# EasyEDA Pro project ProPrj_Smart_Screen_T113_PCB6.epro, board PCB
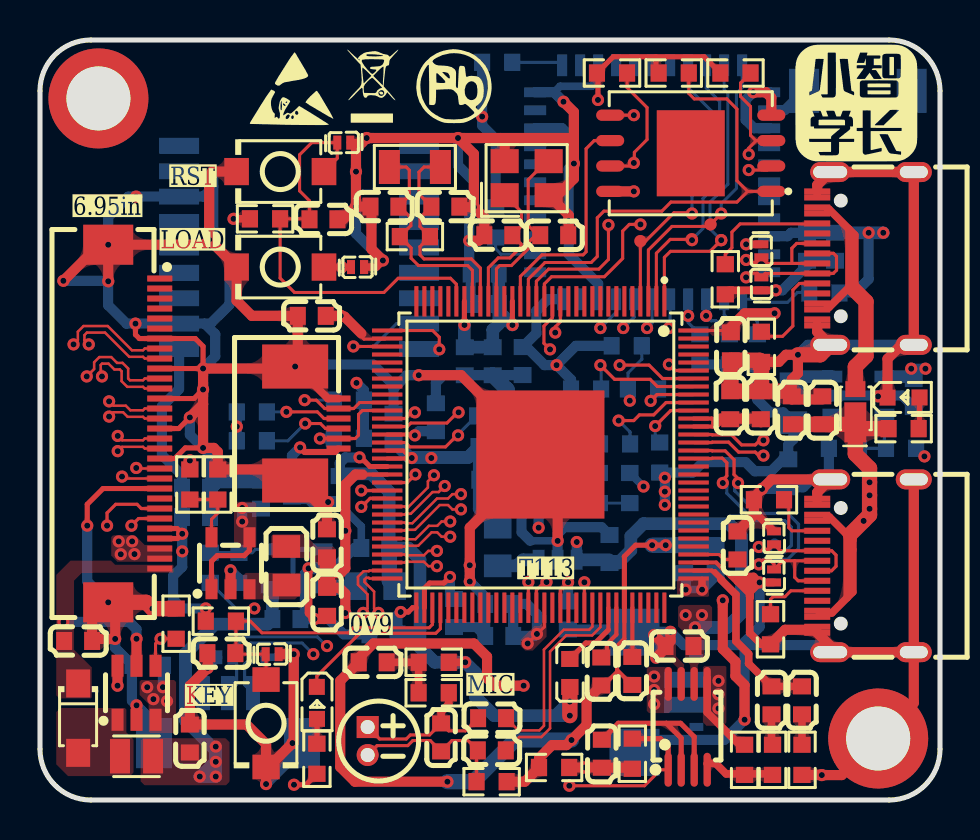
[diagram p7: board, top side]
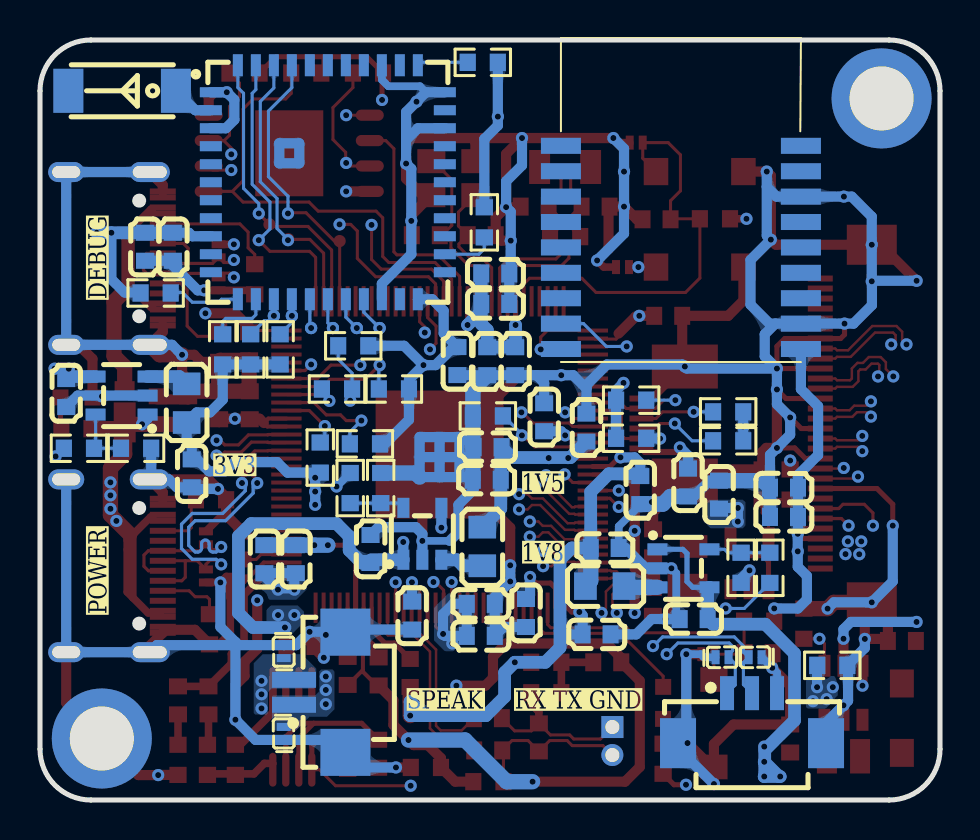
[diagram p8: board, bottom side, seen from below]

Outline 45 x 38 mm; copper layers: Top Layer, GND02, SIG03, Power04, GND05, Bottom Layer. Coordinates in mm from the lower left corner of the outline.
Outline path: 0,35.46 0,2.54 arc(0.74,0.74) 2.54,0 42.46,0 arc(44.26,0.74) 45,2.54 45,35.46 arc(44.26,37.26) 42.46,38 2.54,38 arc(0.74,37.26) 0,35.46
Stack: Top Layer 0.035mm 外层铜厚1oz / Dielectric1 0.0994mm 3313 RC57% 4.2mil / GND02 0.035mm / Dielectric2 0.55mm 0.55mm H/H No copper / SIG03 0.035mm / Dielectric3 0.1088mm 2116 RC54% 4.9mil / Power04 0.0152mm 内层铜厚 / Dielectric4 0.55mm 0.55mm H/H No copper / GND05 0.0152mm 内层铜厚 / Dielectric5 0.0994mm 3313 RC57% 4.2mil / Bottom Layer 0.035mm 外层铜厚1oz

## Design rules (mm)
net MIC_IN_3P: DP8
net MIC_IN_3N: DP8
net USB1_DP: DP1
net USB1_DM: DP1
net USB0_DM: DP2
net USB0_DP: DP2
net LCD_CLK_P: DP3
net LCD_CLK_N: DP3
net MIPI_0_P: DP10
net MIPI_0_N: DP10
net MIPI_1_P: DP11
net MIPI_1_N: DP11
net MIPI_2_P: DP12
net MIPI_2_N: DP12
net MIPI_3_P: DP13
net MIPI_3_N: DP13
template: 自定义配置
spacing copperThickness1oz (default): track to track 0.102, other pairs 0.152 to 0.3
spacing copperThickness2oz: track to track 0.203, other pairs 0.152 to 0.3
track width copperThickness1oz (default): min 0.127, default 0.152, max 2.54
track width copperThickness2oz: min 0.203, default 0.254, max 2.54
track width 3313_50ohm_单端: min 0.157, default 0.157, max 0.157
differential pair differentialPair (default): width min 0.127, default 0.127, max 2.54; gap min 0.152, default 0.203
differential pair 3313_100ohm_差分: width min 0.124, default 0.124, max 0.124; gap min 0.203, default 0.203
differential pair 3313_90ohm_差分: width min 0.157, default 0.157, max 0.157; gap min 0.203, default 0.203
via viaSize (default): diameter min 0.5, default 0.61, max 10; hole min 0.3, default 0.305, max 6.299
net WL_SDIO_D1 uses 3313_50ohm_单端
net WL_SDIO_D0 uses 3313_50ohm_单端
net WL_SDIO_CMD uses 3313_50ohm_单端
net WL_SDIO_D3 uses 3313_50ohm_单端
net WL_SDIO_D2 uses 3313_50ohm_单端
net WL_SDIO_CLK uses 3313_50ohm_单端
net USB1_DP uses 3313_90ohm_差分
net USB1_DM uses 3313_90ohm_差分
net USB0_DM uses 3313_90ohm_差分
net USB0_DP uses 3313_90ohm_差分
net LCD_CLK_P uses 3313_100ohm_差分
net LCD_CLK_N uses 3313_100ohm_差分
net MIPI_LCD_RST uses 3313_50ohm_单端
net MIPI_LCD_TE uses 3313_50ohm_单端
net MIPI_0_P uses 3313_100ohm_差分
net MIPI_0_N uses 3313_100ohm_差分
net MIPI_1_P uses 3313_100ohm_差分
net MIPI_1_N uses 3313_100ohm_差分
net MIPI_2_P uses 3313_100ohm_差分
net MIPI_2_N uses 3313_100ohm_差分
net MIPI_3_P uses 3313_100ohm_差分
net MIPI_3_N uses 3313_100ohm_差分
diff pair DP1 uses 3313_90ohm_差分
diff pair DP2 uses 3313_90ohm_差分
diff pair DP3 uses 3313_100ohm_差分
diff pair DP10 uses 3313_100ohm_差分
diff pair DP11 uses 3313_100ohm_差分
diff pair DP12 uses 3313_100ohm_差分
diff pair DP13 uses 3313_100ohm_差分

## Placement (name value [footprint] x y rotation side)
C1  100nF  [C0603]  20.7 9.35 270 bottom
C9  10uF  [C0603]  22.96 9.81 0 bottom
C12  100nF  [C0603]  22.96 8.21 0 bottom
C13  10uF  [C0603]  17.68 18.62 270 bottom
C14  100nF  [C0603]  22.62 17.64 180 bottom
C15  100nF  [C0603]  26.39 9.22 90 bottom
C16  100nF  [C0603]  12.6 15.88 90 bottom
C17  100nF  [C0603]  13.59 24.21 0 top
C19  100nF  [C0603]  34.54 22.68 90 top
C21  100nF  [C0603]  22.64 21.94 90 bottom
C27  10uF  [C0603]  14.35 12.83 270 top
C28  10uF  [C0603]  34.51 19.74 270 top
C29  100nF  [C0603]  19.79 19.14 270 bottom
C30  100nF  [C0603]  36.04 19.74 270 top
C31  10uF  [C0603]  32.21 12.04 270 bottom
C33  10uF  [C0603]  22.24 24.8 0 bottom
C34  100nF  [C0603]  22.24 26.33 0 bottom
C36  100nF  [C0603]  14.99 15.5 90 bottom
C37  100nF  [C0603]  17.17 8.28 0 bottom
C38  100nF  [C0603]  21.24 21.94 90 bottom
C41  100nF  [C0603]  14.17 29.03 180 top
C63  100nF  [C0603]  38.35 27.66 90 bottom
C64  10uF  [C0603]  39.75 27.66 90 bottom
C65  10uF  [C0603]  24.13 21.95 90 bottom
C82  470nF  [C0603]  29.62 6.45 270 top
C83  470nF  [C0603]  28.07 6.43 270 top
C85  100nF  [C0603]  22.61 4.09 0 top
C86  100nF  [C0603]  22.59 2.48 0 top
C87  100pF  [C0603]  20.06 3.13 90 top
C88  2.2uF  [C0603]  33.78 12.04 270 bottom
C91  100nF  [C0603]  34.87 12.73 270 top
C107  10uF  [C0603]  43.69 20.35 90 bottom
C108  10uF  [C0603]  37.41 16.33 90 bottom
C109  10uF  [C0603]  28.47 12.55 270 bottom
C110  10uF  [C0603]  22.66 16.01 180 bottom
C111  10uF  [C0603]  11.05 15.27 270 bottom
C112  10uF  [C0603]  14.36 9.91 90 top
C115  10uF  [C0603]  39.12 19.48 270 top
C116  100nF  [C0603]  37.59 19.48 270 top
C119  1uF  [C0603]  1.91 7.95 180 top
C120  12pF  [C0603]  20.27 29.67 0 top
C121  12pF  [C0603]  17.22 29.67 0 top
C122  12pF  [C0603]  22.92 28.24 0 top
C123  12pF  [C0603]  25.71 28.24 180 top
C124  100nF  [C0603]  9.07 7.34 0 top
C135  100nF  [C0603]  38.1 4.98 270 top
C138  1uF  [C0603]  28.09 2.31 90 top
C139  10uF  [C0603]  31.98 7.7 0 top
C141  1uF  [C0603]  7.49 3.08 270 top
C142  470nF  [C0603]  36.58 4.98 270 top
C143  10uF  [C0603]  16.64 6.88 180 top
C144  10uF  [C0603]  7.8 15.62 180 bottom
C145  100nF  [C0603]  7.8 14.15 180 bottom
C146  10uF  [C0603]  12.32 9.04 180 bottom
C147  10uF  [C0603]  16.76 12.6 0 bottom
CN2  HC-1.25-2PWT  [CONN-SMD_2P-P1.25-HC-1.25-2PWT]  31.01 5.39 90 bottom
D19  LMBR240ET1G  [SOD323HE_L1.8-W1.3-LS2.5-RD-1]  40.77 19.71 90 top
D22  LMBR240FT1G  [SOD-123FL_L2.7-W1.8-LS3.8-RD]  1.91 4.09 270 top
FPC2  FPC-05F-30PH20  [FPC-SMD_30P-P0.50_XUNPU_FPC-05F-30PH20]  4.7 18.82 270 top
FPC7  AFC07-S06ECA-00  [FPC-SMD_P0.50-6P_LCS-SJ-H2.0]  13.84 18.82 90 top
L8  GZ1608D601TF  [L0603]  26.49 6.35 270 top
L10  AN2051-245  [ANT2051]  40.89 35.46 0 bottom
L15  2.2uH  [L0805]  37.67 19.84 270 bottom
L16  2.2uH  [L0805]  22.89 12.68 90 bottom
L17  2.2uH  [L0805]  12.32 11.71 90 top
L18  10uH  [IND-SMD_L2.0-W1.6]  4.83 2.19 0 top
L19  2.2uH  [L0805]  16.76 10.69 0 bottom
LED3  NCD0603B1  [LED0603-RD]  43.18 20.12 0 top
LED4  NCD0603B1  [LED0603-RD]  13.84 4.86 270 top
MIC2  GMI4015P-2C-42db  [MIC-TH_BD4.0-P1.40-D0.4-L-FD]  16.38 2.95 270 top
NOREF  -  [Pad_e3778]  32.59 28.04 180 top
NOREF#2  -  [Pad_e3757]  29.16 23.6 0 top
NOREF#3  -  [Pad_e3754]  33.31 24.21 0 top
NOREF#4  -  [Pad_e3755]  32.41 24.21 0 top
NOREF#5  -  [Pad_e3756]  28.02 23.6 0 top
NOREF#6  -  [Pad_e12601]  2.92 35.08 180 top
NOREF#7  -  [Pad_e3765]  30.35 23.6 180 top
NOREF#8  -  [Pad_e3768]  34.06 27.99 180 top
NOREF#9  -  [Pad_e12602]  41.91 3.08 180 top
NOREF#10  -  [Pad_e3767]  30.02 27.95 180 top
NOREF#11  -  [Pad_e3769]  33.53 28.78 180 top
NOREF#12  -  [Pad_e3763]  31.44 23.6 0 top
R13  10kΩ  [R0603]  11.25 29.06 180 top
R14  10MΩ  [R0603]  18.75 28.17 0 top
R52  10kΩ  [R0603]  22.86 36.88 180 bottom
R79  0Ω  [R0603]  25.7 1.63 180 top
R90  33Ω  [R0603]  30.15 20.55 180 bottom
R91  10kΩ  [R0603]  22.78 28.88 90 bottom
R93  10kΩ  [R0603]  28.6 36.35 180 top
R107  150kΩ  [R0603]  40.2 17.59 0 bottom
R108  680kΩ  [R0603]  43.05 17.59 0 bottom
R109  300kΩ  [R0603]  29.49 15.6 90 bottom
R110  150kΩ  [R0603]  7.49 15.77 90 top
R111  200kΩ  [R0603]  27.97 15.6 270 bottom
R112  300kΩ  [R0603]  8.89 15.77 270 top
R113  5.1kΩ  [R0603]  36.52 8.54 90 top
R114  5.1kΩ  [R0603]  36.45 15.01 180 top
R115  10kΩ  [R0603]  43.18 18.57 0 top
R120  10kΩ  [R0603]  6.81 8.82 270 top
R121  10Ω  [R0603]  5.38 6.73 0 bottom
R122  10kΩ  [R0603]  31.69 36.35 180 top
R123  240Ω  [R0603]  22.61 19.2 180 bottom
R124  10kΩ  [R0603]  13.84 2.06 90 top
R126  10kΩ  [R0603]  9.04 8.94 180 top
R135  22Ω  [R0603]  38.1 2.01 90 top
R136  20kΩ  [R0603]  36.63 2.01 270 top
R138  100kΩ  [R0603]  29.62 2.31 90 top
R141  5.1kΩ  [R0603]  36.07 22.66 90 top
R142  5.1kΩ  [R0603]  34.26 26.04 270 top
R145  10kΩ  [R0603]  34.77 36.35 0 top
R146  1kΩ  [R0603]  22.58 0.92 180 top
R147  1kΩ  [R0603]  19.69 5.36 180 top
R148  75Ω  [R0603]  19.69 6.88 0 top
R149  20kΩ  [R0603]  35.23 2.01 90 top
R150  200kΩ  [R0603]  8.51 11.61 270 bottom
R151  100kΩ  [R0603]  9.94 11.61 90 bottom
R152  10kΩ  [R0603]  32.99 22.53 270 bottom
R153  10kΩ  [R0603]  34.47 22.53 270 bottom
R154  10kΩ  [R0603]  35.86 22.53 270 bottom
R155  10kΩ  [R0603]  39.22 25.35 0 bottom
R156  10kΩ  [R0603]  27.3 20.55 180 bottom
R157  10kΩ  [R0603]  28.75 17.81 180 bottom
R158  10kΩ  [R0603]  29.34 22.71 180 bottom
R159  10kΩ  [R0603]  30.99 17.12 270 bottom
R160  10kΩ  [R0603]  15.44 18.09 0 bottom
R161  10kΩ  [R0603]  10.59 17.96 180 bottom
R162  10kΩ  [R0603]  10.59 19.41 180 bottom
R163  10kΩ  [R0603]  15.44 19.99 0 bottom
SW1  TS-1088-AR02016  [SW-SMD_L3.9-W3.0-P4.45]  12.01 26.65 180 top
SW2  TS-1088-AR02016  [SW-SMD_L3.9-W3.0-P4.45]  12.01 31.42 180 top
SW5  TS-1088-AR02016  [SW-SMD_L3.9-W3.0-P4.45]  11.3 3.84 270 top
T1  T113_S3  [TQFP-128_L14.0-W14.0-P0.40-LS16.0-BL-EP6.4]  25.02 17.27 180 top
U1  W25N01GVZEIG  [WSON-8_L8.0-W6.10-P1.27-BL-EP]  32.54 32.34 90 top
U5  -  [MX02]  6.98 21.87 90 bottom
U11  RTL8723DS模块  [WIFIM-SMD_44P-L12.0-W12.0-P0.90_RTL8723DS]  30.61 30.89 180 bottom
U21  ESD5451N  [X1-DFN1006-2_L1.0-W0.6-P0.65-BI]  15.88 26.65 0 top
U24  ZX-MX1.25-3PWT  [CONN-SMD_3P-P1.25_MEGASTAR_ZX-MX1.25-3PWT]  9.4 4.09 180 bottom
U27  SY8088AAC  [SOT-23-5_L3.0-W1.7-P0.95-LS2.8-BR]  40.92 20.22 180 bottom
U28  SY8088AAC  [SOT-23-5_L3.0-W1.7-P0.95-LS2.8-BR]  25.88 13.31 270 bottom
U29  SY8088AAC  [SOT-23-5_L3.0-W1.7-P0.95-LS2.8-BR]  9.52 11.84 270 top
U33  ESD5451N  [X1-DFN1006-2_L1.0-W0.6-P0.65-BI]  36.07 27.46 270 top
U34  ESD5451N  [X1-DFN1006-2_L1.0-W0.6-P0.65-BI]  36.07 25.81 270 top
U35  ESD5451N  [X1-DFN1006-2_L1.0-W0.6-P0.65-BI]  36.7 11.2 90 top
U36  ESD5451N  [X1-DFN1006-2_L1.0-W0.6-P0.65-BI]  36.7 13.11 270 top
U37  ESD5451N  [X1-DFN1006-2_L1.0-W0.6-P0.65-BI]  9.25 7.14 0 bottom
U38  ESD5451N  [X1-DFN1006-2_L1.0-W0.6-P0.65-BI]  10.9 7.14 0 bottom
U41  ESD5451N  [X1-DFN1006-2_L1.0-W0.6-P0.65-BI]  15.19 32.87 180 top
U42  ESD5451N  [X1-DFN1006-2_L1.0-W0.6-P0.65-BI]  11.61 7.29 180 top
U47  LM4890S  [MSOP-8_L3.0-W3.0-P0.65-LS5.0-BL]  32.38 3.66 0 top
U49  ESD5451N  [X1-DFN1006-2_L1.0-W0.6-P0.65-BI]  32.82 7.42 270 bottom
U50  ESD5451N  [X1-DFN1006-2_L1.0-W0.6-P0.65-BI]  32.82 3.33 90 bottom
U52  MT9201  [SOT-23-6_L2.9-W1.6-P0.95-LS2.8-BR]  4.83 5.36 270 top
U53  SY8088AAC  [SOT-23-5_L3.0-W1.7-P0.95-LS2.8-BR]  12.83 11.58 0 bottom
USB9  KH-TYPE-C-16P  [usb-c-smd_kh-type-c-16p]  41.27 11.71 90 top
USB10  KH-TYPE-C-16P  [usb-c-smd_kh-type-c-16p]  41.27 27.08 90 top
X1  XL2EL89COI-111YLC-24M  [CRYSTAL-SMD_4P-L3.2-W2.5-BL]  24.33 31.09 0 top
X2  32.768kHz  [OSC-SMD_L3.2-W1.5]  18.75 31.65 180 top

## Footprints (pads in the part's own frame, mm; a bottom-side part is the same pattern mirrored in y, then rotated)
ANT2051
  rect 1.5x2.2 smd: 1(-2.69,0) 2(2.69,0)
C0603
  rect 0.8x0.9 smd: 1(-0.7,0) 2(0.7,0)
CONN-SMD_2P-P1.25-HC-1.25-2PWT
  rect 0.8x2.2 smd: 1(-0.625,1.285) 2(0.625,1.285)
  rect 2.35x2.5 smd: 3(-3.005,-1.285) 4(3.005,-1.285)
CONN-SMD_3P-P1.25_MEGASTAR_ZX-MX1.25-3PWT
  rect 0.7x1.7 smd: 1(-1.25,1.25) 2(0,1.25) 3(1.25,1.25)
  rect 1.8x2.5 smd: 4(-3.7,-1.25) 5(3.7,-1.25)
CRYSTAL-SMD_4P-L3.2-W2.5-BL
  rect 1.4x1.2 smd: 1(-1.1,-0.85) 2(1.1,-0.85) 3(1.1,0.85) 4(-1.1,0.85)
FPC-SMD_30P-P0.50_XUNPU_FPC-05F-30PH20
  rect 0.3x1.25 smd: 1(-7.25,1.288) 2(-6.75,1.288) 3(-6.25,1.288) 4(-5.75,1.288) 5(-5.25,1.288) 6(-4.75,1.288) 7(-4.25,1.288) 8(-3.75,1.288) 9(-3.25,1.288) 10(-2.75,1.288) 11(-2.25,1.288) 12(-1.75,1.288) 13(-1.25,1.288) 14(-0.75,1.288) 15(-0.25,1.288) 16(0.25,1.288) 17(0.75,1.288) 18(1.25,1.288) 19(1.75,1.288) 20(2.25,1.288) 21(2.75,1.288) 22(3.25,1.288) 23(3.75,1.288) 24(4.25,1.288) 25(4.75,1.288) 26(5.25,1.288) 27(5.75,1.288) 28(6.25,1.288) 29(6.75,1.288) 30(7.25,1.288)
  rect 2x2.5 smd: 31(8.94,-1.288) 32(-8.94,-1.288)
FPC-SMD_P0.50-6P_LCS-SJ-H2.0
  rect 0.3x1.2 smd: 1(1.25,-1.085) 2(0.75,-1.085) 3(0.25,-1.085) 4(-0.25,-1.085) 5(-0.75,-1.085) 6(-1.25,-1.085)
  rect 2.2x3.3 smd: 7(2.85,1.085) 8(-2.85,1.085)
IND-SMD_L2.0-W1.6
  rect 1x1.72 smd: 1(0.828,0) 2(-0.828,0)
L0603
  rect 0.8x0.864 smd: 1(-0.7,0) 2(0.7,0)
L0805
  rect 1.133x1.377 smd: 1(-0.966,0) 2(0.966,0)
LED0603-RD
  rect 0.8x0.8 smd: 1(-0.799,-0.004) 2(0.799,0.004)
MIC-TH_BD4.0-P1.40-D0.4-L-FD
  rect 1.1x1.1 hole 0.7: 1(-0.7,0)
  round 1.1 hole 0.7: 2(0.7,0)
MSOP-8_L3.0-W3.0-P0.65-LS5.0-BL
  oval 0.364x1.692 smd: 1(-0.975,-2.146) 2(-0.325,-2.146) 3(0.325,-2.146) 4(0.975,-2.146) 5(0.975,2.146) 6(0.325,2.146) 7(-0.325,2.146) 8(-0.975,2.146)
MX02
  rect 0.8x2 smd: 1(10.838,11.969) 2(9.568,11.969) 3(8.298,11.969) 4(7.028,11.969) 5(5.758,11.969) 6(4.488,11.969) 7(3.218,11.969) 8(1.948,11.969) 9(0.678,11.969) 10(0.678,-0.031) 11(1.948,-0.031) 12(3.218,-0.031) 13(4.488,-0.031) 14(5.758,-0.031) 15(7.028,-0.031) 16(8.298,-0.031) 17(9.568,-0.031) 18(10.838,-0.031)
OSC-SMD_L3.2-W1.5
  rect 1.05x1.7 smd: 1(-1.275,0) 2(1.275,0)
Pad_e3754
  round 0.61 smd far side: TP22(0,0)
Pad_e3755
  round 0.61 smd far side: TP23(0,0)
Pad_e3756
  round 0.61 smd far side: TP24(0,0)
Pad_e3757
  round 0.61 smd far side: TP25(0,0)
Pad_e3763
  round 0.61 smd far side: TP26(0,0)
Pad_e3765
  round 0.61 smd far side: TP27(0,0)
Pad_e3767
  round 0.61 smd: TP28(0,0)
Pad_e3768
  round 0.61 smd: TP29(0,0)
Pad_e3769
  round 0.61 smd: TP30(0,0)
Pad_e3778
  round 0.61 smd: TP31(0,0)
Pad_e12601
  round 5 hole 3.2: 1(0,0)
Pad_e12602
  round 5 hole 3.2: 1(0,0)
R0603
  rect 0.806x0.864 smd: 1(-0.753,0) 2(0.753,0)
SOD323HE_L1.8-W1.3-LS2.5-RD-1
  rect 2x1.1 smd: 1(-0.83,0.001)
  rect 0.8x1 smd: 2(0.83,-0.002)
SOD-123FL_L2.7-W1.8-LS3.8-RD
  rect 1.4x1.2 smd: 1(-1.735,0) 2(1.735,0)
SOT-23-5_L3.0-W1.7-P0.95-LS2.8-BR
  rect 1x0.6 smd: 1(1.3,-0.95) 2(1.3,0) 3(1.3,0.95) 4(-1.3,0.95) 5(-1.3,-0.95)
SOT-23-6_L2.9-W1.6-P0.95-LS2.8-BR
  rect 1.1x0.6 smd: 1(1.35,-0.95) 2(1.35,0) 3(1.35,0.95) 4(-1.35,0.95) 5(-1.35,0) 6(-1.35,-0.95)
SW-SMD_L3.9-W3.0-P4.45
  rect 1.23x1.36 smd: 1(-2.185,0) 2(2.185,0)
TQFP-128_L14.0-W14.0-P0.40-LS16.0-BL-EP6.4
  rect 0.2x1.52 smd: 1(-6.2,-7.66) 2(-5.8,-7.66) 3(-5.4,-7.66) 4(-5,-7.66) 5(-4.6,-7.66) 6(-4.2,-7.66) 7(-3.8,-7.66) 8(-3.4,-7.66) 9(-3,-7.66) 10(-2.6,-7.66) 11(-2.2,-7.66) 12(-1.8,-7.66) 13(-1.4,-7.66) 14(-1,-7.66) 15(-0.6,-7.66) 16(-0.2,-7.66) 17(0.2,-7.66) 18(0.6,-7.66) 19(1,-7.66) 20(1.4,-7.66) 21(1.8,-7.66) 22(2.2,-7.66) 23(2.6,-7.66) 24(3,-7.66) 25(3.4,-7.66) 26(3.8,-7.66) 27(4.2,-7.66) 28(4.6,-7.66) 29(5,-7.66) 30(5.4,-7.66) 31(5.8,-7.66) 32(6.2,-7.66) 65(6.2,7.66) 66(5.8,7.66) 67(5.4,7.66) 68(5,7.66) 69(4.6,7.66) 70(4.2,7.66) 71(3.8,7.66) 72(3.4,7.66) 73(3,7.66) 74(2.6,7.66) 75(2.2,7.66) 76(1.8,7.66) 77(1.4,7.66) 78(1,7.66) 79(0.6,7.66) 80(0.2,7.66) 81(-0.2,7.66) 82(-0.6,7.66) 83(-1,7.66) 84(-1.4,7.66) 85(-1.8,7.66) 86(-2.2,7.66) 87(-2.6,7.66) 88(-3,7.66) 89(-3.4,7.66) 90(-3.8,7.66) 91(-4.2,7.66) 92(-4.6,7.66) 93(-5,7.66) 94(-5.4,7.66) 95(-5.8,7.66) 96(-6.2,7.66)
  rect 1.52x0.2 smd: 33(7.66,-6.2) 34(7.66,-5.8) 35(7.66,-5.4) 36(7.66,-5) 37(7.66,-4.6) 38(7.66,-4.2) 39(7.66,-3.8) 40(7.66,-3.4) 41(7.66,-3) 42(7.66,-2.6) 43(7.66,-2.2) 44(7.66,-1.8) 45(7.66,-1.4) 46(7.66,-1) 47(7.66,-0.6) 48(7.66,-0.2) 49(7.66,0.2) 50(7.66,0.6) 51(7.66,1) 52(7.66,1.4) 53(7.66,1.8) 54(7.66,2.2) 55(7.66,2.6) 56(7.66,3) 57(7.66,3.4) 58(7.66,3.8) 59(7.66,4.2) 60(7.66,4.6) 61(7.66,5) 62(7.66,5.4) 63(7.66,5.8) 64(7.66,6.2) 97(-7.66,6.2) 98(-7.66,5.8) 99(-7.66,5.4) 100(-7.66,5) 101(-7.66,4.6) 102(-7.66,4.2) 103(-7.66,3.8) 104(-7.66,3.4) 105(-7.66,3) 106(-7.66,2.6) 107(-7.66,2.2) 108(-7.66,1.8) 109(-7.66,1.4) 110(-7.66,1) 111(-7.66,0.6) 112(-7.66,0.2) 113(-7.66,-0.2) 114(-7.66,-0.6) 115(-7.66,-1) 116(-7.66,-1.4) 117(-7.66,-1.8) 118(-7.66,-2.2) 119(-7.66,-2.6) 120(-7.66,-3) 121(-7.66,-3.4) 122(-7.66,-3.8) 123(-7.66,-4.2) 124(-7.66,-4.6) 125(-7.66,-5) 126(-7.66,-5.4) 127(-7.66,-5.8) 128(-7.66,-6.2)
  rect 6.4x6.4 smd: 129(0,0)
usb-c-smd_kh-type-c-16p
  oval 1x2 hole 0.6x1.7: 1(-4.32,1.765) 2(4.32,1.765)
  oval 1x1.8 hole 0.6x1.4: 3(-4.32,-2.415) 4(4.32,-2.415)
  rect 0.3x1.3 smd: A1(-3.35,2.415) A4(-2.55,2.415) A5(-1.25,2.415) A6(-0.25,2.415) A7(0.25,2.415) A8(1.25,2.415) A9(2.55,2.415) A12(3.35,2.415) B1(3.05,2.415) B4(2.25,2.415) B5(1.75,2.415) B6(0.75,2.415) B7(-0.75,2.415) B8(-1.75,2.415) B9(-2.25,2.415) B12(-3.05,2.415)
WIFIM-SMD_44P-L12.0-W12.0-P0.90_RTL8723DS
  rect 1.1x0.5 smd: 1(-5.85,4.5) 2(-5.85,3.6) 3(-5.85,2.7) 4(-5.85,1.8) 5(-5.85,0.9) 6(-5.85,0) 7(-5.85,-0.9) 8(-5.85,-1.8) 9(-5.85,-2.7) 10(-5.85,-3.6) 11(-5.85,-4.5) 23(5.85,-4.5) 24(5.85,-3.6) 25(5.85,-2.7) 26(5.85,-1.8) 27(5.85,-0.9) 28(5.85,0) 29(5.85,0.9) 30(5.85,1.8) 31(5.85,2.7) 32(5.85,3.6) 33(5.85,4.5)
  rect 0.5x1.1 smd: 12(-4.5,-5.85) 13(-3.6,-5.85) 14(-2.7,-5.85) 15(-1.8,-5.85) 16(-0.9,-5.85) 17(0,-5.85) 18(0.9,-5.85) 19(1.8,-5.85) 20(2.7,-5.85) 21(3.6,-5.85) 22(4.5,-5.85) 34(4.5,5.85) 35(3.6,5.85) 36(2.7,5.85) 37(1.8,5.85) 38(0.9,5.85) 39(0,5.85) 40(-0.9,5.85) 41(-1.8,5.85) 42(-2.7,5.85) 43(-3.6,5.85) 44(-4.5,5.85)
WSON-8_L8.0-W6.10-P1.27-BL-EP
  oval 0.56x1.4 smd: 1(-1.905,-4.027) 2(-0.635,-4.027) 3(0.635,-4.027) 4(1.905,-4.027) 5(1.905,4.027) 6(0.635,4.027) 7(-0.635,4.027) 8(-1.905,4.027)
  rect 4.3x3.4 smd: 9(0,0)
X1-DFN1006-2_L1.0-W0.6-P0.65-BI
  rect 0.4x0.7 smd: 1(-0.325,0) 2(0.325,0)

## Nets
As in the schematic, except:
GND: C1.2 C9.1 C12.1 C13.1 C14.1 C15.1 C16.1 C17.1 C19.1 C21.1 C27.1 C28.1 C29.1 C30.1 C33.1 C34.1 C36.1 C37.1 C38.1 C41.1 C63.1 C64.1 C65.1 C91.1 C107.1 C108.1 C109.1 C110.1 C111.1 C112.1 C115.1 C116.1 C119.1 C120.2 C121.1 C122.1 C123.1 C124.1 C138.1 C139.1 C141.1 C144.1 C145.1 C146.1 C147.1 CN2.3 CN2.4 FPC2.7 FPC2.10 FPC2.13 FPC2.16 FPC2.19 FPC2.22 FPC2.31 FPC2.32 FPC7.1 FPC7.7 FPC7.8 LED3.1 NOREF#6.1 NOREF#9.1 R79.1 R107.1 R111.1 R112.1 R113.1 R114.2 R120.1 R121.1 R123.1 R135.1 R138.1 R141.1 R142.2 R151.1 SW1.2 SW2.2 SW5.2 T1.99 T1.129 U1.4 U1.9 U5.11 U5.16 U11.1 U11.3 U11.20 U11.31 U11.33 U11.36 U21.2 U24.3 U24.4 U24.5 U27.2 U28.2 U29.2 U33.1 U34.2 U35.1 U36.1 U37.1 U38.2 U41.1 U42.1 U47.7 U49.1 U50.1 U52.2 U53.2 USB9.1 USB9.2 USB9.3 USB9.4 USB9.A1 USB9.A12 USB9.B1 USB9.B12 USB10.1 USB10.2 USB10.3 USB10.4 USB10.A1 USB10.A12 USB10.B1 USB10.B12 X1.2 X1.4
UART1_CTS: NOREF#10.TP28 T1.4 U11.41
UART1_RTS: NOREF#11.TP30 T1.3 U11.44
UART1_RX: NOREF.TP31 T1.2 U11.42
UART1_TX: NOREF#8.TP29 T1.1 U11.43
WL_SDIO_CMD: NOREF#12.TP26 R159.1 T1.118 U11.16
WL_SDIO_D0: NOREF#2.TP25 R157.1 T1.119 U11.18
WL_SDIO_D1: NOREF#5.TP24 R156.1 T1.121 U11.19
WL_SDIO_D2: NOREF#3.TP22 R153.1 T1.123 U11.14
WL_SDIO_D3: NOREF#4.TP23 R152.1 T1.122 U11.15
$2N981: NOREF#7.TP27 R90.2 R158.1 U11.17

Pads without a net: FPC2 1 2 3 4 5 6 23; L10 2; T1 5 6 7 8 9 10 11 12 13 21 28 29 30 31 32 36 37 38 39 40 41 69 70 71 72 73 74 75 76 77 78 82 84 85 93 94 95 96 101 102 103 104 105 106 107 108 109 110 111 124 125 126 127; U5 1 2 3 4 5 6 7 12 13 14 15 17 18; U11 4 5 6 7 8 10 11 21 23 25 26 27 28 29 30 32 35 37 38 39 40; USB9 A8 B8; USB10 A8 B8

## Via types
v1: diameter 0.61, hole 0.305, Top Layer to Bottom Layer, 210 vias

## Routing (per net, layer and track width the routed paths; a pad name or vN(x,y) marks a point on that pad's centre or on a via; arc(x,y) is an arc through that point)
0V9: length 78
  Top Layer w0.152: v1(24.38,7.83) 25.22,8.66 T1.81
  Top Layer w0.203: T1.116 33.63,18.67 33.81,18.85 33.58,19.07 T1.117 ; v1(18.74,18.23) 18.7,18.27 T1.46 ; T1.51 16.12,16.27
  Top Layer w0.508: v1(15.27,9.35) 15.27,10.31 14.97,10.61 C112.2 ; 14.27,12.13 14.37,12.13 ; 16.12,16.27 15.78,16.27 15.27,15.76 v1(15.27,13.46) 15.27,11.58 15.04,11.36 14.53,11.36 ; 36.04,18.89 35.86,19.07 v1(35.25,19.07) 34.02,19.07 33.81,18.85
  Top Layer w0.635: v1(7.49,16.97) R110.2
  Top Layer w0.762: 14.37,12.1 14.37,10.77
  GND05 w0.508: 15.8,10.16 18.75,10.16 20.16,8.75 23.46,8.75 ; 15.8,10.16 15.27,10.7 ; 15.8,10.16 15.66,10.16 15.27,9.77 ; 15.27,9.77 15.27,10.7 ; 15.27,9.77 v1(15.27,9.35) ; 15.27,10.7 v1(15.27,13.46) 15.27,15.24 14.66,15.85 ; 23.85,8.35 v1(24.38,7.83) 24.91,8.35 23.85,8.35 ; 23.85,8.35 23.6,8.61 ; 14.66,15.85 14.25,16.26 8.21,16.26 v1(7.49,16.97) ; 14.66,15.85 14.66,17.35 15.54,18.23 v1(18.74,18.23) ; v1(35.25,19.07) 33.41,17.22 33.41,15.25 32.05,13.9 30.08,13.9 28.31,12.12 24.28,12.12 23.6,11.43 23.6,8.88 ; 23.46,8.75 23.6,8.61 ; 23.46,8.75 23.6,8.88 ; 23.6,8.61 23.6,8.88
  Bottom Layer w0.508: C29.2 18.95,18.44 v1(18.74,18.23) ; 24.75,8.21 v1(24.85,8.3) 24.85,9.29 24.33,9.81 C9.2 C12.2 24.75,8.21
1V5: length 25.2
  Top Layer w0.203: T1.49 18.27,17.07 18.41,17.22 18.16,17.47 T1.48
  GND05 w0.508: v1(30.17,15.67) 28.83,15.67 28.07,14.91 23.52,14.91 21.33,17.1 v1(19.57,17.1) v1(18.59,17.1)
  Bottom Layer w0.152: 30.17,15.67 v1(30.17,15.67)
  Bottom Layer w0.381: R109.2 30.17,15.67
  Bottom Layer w0.635: 22.89,13.64 21.96,14.57 C110.2 21.96,17.6 C14.2 21.4,17.12 18.48,17.12 17.68,17.92
1V8: length 120.1
  Top Layer w0.254: v1(18.03,9.4) 18.41,9.4 18.63,9.61 T1.65 ; v1(15.98,17.13) 16.04,17.13 16.5,16.67 T1.50 ; T1.20 23.62,23.75 v1(23.62,23.75) ; T1.26 21.22,23.75
  Top Layer w0.381: R148.2 v1(21.26,6.88) ; v1(33.1,10.52) 33.1,10.97
  Top Layer w0.762: v1(26.49,4.22) v1(26.49,4.92) L8.2
  GND05 w0.508: 11.53,8.16 11.48,8.21 11.48,9.17 11.07,9.58 v1(10.72,9.58)
  GND05 w0.635: v1(23.62,23.75) v1(21.22,23.75) 18.47,23.75 16.84,25.38 8.84,25.38 6.66,23.19 6.66,16.44 7.57,15.52 11.35,15.52 11.99,14.89 11.99,8.61 11.53,8.16 11.53,7.13 12.19,6.48 19,6.48 21.26,4.22 25.74,4.22 ; 26.49,4.97 25.74,4.22 ; 26.49,4.97 26.49,6.28 30.73,10.52 v1(32.28,10.52) v1(33.1,10.52) ; 26.49,4.97 v1(26.49,4.92) v1(26.49,4.22) 25.74,4.22
  Bottom Layer w0.152: v1(10.72,9.58) 9.79,9.58 R150.2 8.5,10.85
  Bottom Layer w0.381: v1(32.28,10.52) v1(33.1,10.52)
  Bottom Layer w0.508: v1(32.28,10.52) 32.28,11.27 C31.2 C88.2 33.78,11.2 v1(33.1,10.52) ; 19,8.45 18.83,8.28 C37.2 17.87,9.24 v1(18.03,9.4) ; 21.22,22.66 C38.2 ; C36.2 14.99,16.84 15.27,17.13 v1(15.98,17.13)
  Bottom Layer w0.635: v1(21.22,23.75) 21.22,22.66 ; 25.79,4.22 v1(26.49,4.92) v1(26.49,4.22) 25.79,4.22 ; 25.79,4.22 22.71,4.22 21.77,5.16 21.77,6.38 v1(21.26,6.88) 19.74,6.88 19,7.62 19,12.02 18.41,12.6 17.46,12.6 17.46,15.41 16.56,16.31 15.1,16.31 C36.2 ; 22.94,24.44 v1(23.62,23.75) ; 22.94,24.44 22.94,23.8 22.64,23.5 C21.2 C38.2 ; 22.94,24.44 C33.2 C34.2
  Bottom Layer w0.762: L19.2 17.46,10.96 17.46,12.6
3V3: length 102
  Top Layer w0.152: v1(26.4,10.89) 26.02,10.5 T1.83 ; T1.128 34.45,23.47 C19.2 ; 15.05,24.19 v1(15.04,24.21) ; 17.25,23.05 16.2,23.05 16,23.25 ; R126.2 v1(8.29,9.58)
  Top Layer w0.254: FPC2.27 6.87,13.07 v1(7.11,13.31) 6.85,13.57 FPC2.26 ; R145.1 33.21,37.16 30.8,37.16 ; v1(27.9,35) 27.9,36.3 R93.2 28.66,37.16 30.8,37.16 ; v1(12.7,0.76) 13.3,0.76 R124.1 ; T1.66 19.22,10.58 19.48,10.85 20.19,10.85 v1(20.5,11.15) ; 30.8,37.16 30.8,36.48 R122.2
  Top Layer w0.305: v1(13,17.63) 13.23,17.4 14.76,17.4 FPC7.6
  Top Layer w0.381: R13.2 v1(9.68,29.06)
  Top Layer w0.508: 15.22,24.18 15.05,24.19 ; U1.8 v1(29.69,30.43) ; 14.89,24.21 C17.2 ; 15.24,24.15 16.07,23.32 ; 34.37,23.47 35.23,24.33 v1(36.73,24.33)
  Bottom Layer w0.152: R108.2 44.21,17.18 v1(44.22,17.18)
  Bottom Layer w0.508: R91.2 22.78,33.05 22.11,33.72 v1(22.11,34.17) R52.2 ; v1(25.83,21.74) 26.79,22.71 R158.2 ; v1(25.83,21.74) 26.55,21.02 26.55,19.02 27.76,17.81 R157.2 ; v1(25.83,21.74) 25.22,21.74 24.32,22.65 C65.2 24.82,23.33 24.82,24.46 25.39,25.04 U11.22 ; C63.2 37.56,28.36 37.38,28.19 36.46,28.19 ; v1(20.5,11.15) 20.5,10.25 C1.1 ; U5.10 6.95,20.54 6.1,19.69 6.1,17.25 7.1,16.24 C144.2 C145.2 7.1,13.32 v1(7.11,13.31) v1(7.11,12.43) 7.11,11.66 6.66,11.2 6.66,10.03 7.1,9.58 v1(8.29,9.58) ; R161.2 v1(9.84,18.67) R162.2 ; C16.2 12.6,17.22 v1(13,17.63) ; v1(26.4,10.89) 26.4,9.93 C15.2 ; v1(15.82,20.85) 16.2,20.48 R163.2 R160.2 ; R155.2 40,25.38 40.77,25.38 41.43,26.04 v1(41.43,28.36) ; v1(31.24,14.76) v1(31.24,15.42) v1(31.24,16.11) 30.99,16.37 32.62,16.37 33.15,16.89 35.28,16.89 35.74,16.44 36.55,16.44 37.15,17.03 37.41,17.03 37.41,17.78 37.67,18.04 L15.2 37.16,19.38 36.5,19.38 35.86,20.02 R154.2 R153.2 R152.2
  Bottom Layer w0.635: v1(42.16,28.36) v1(41.43,28.36) C64.2 C63.2
5V: length 173
  Top Layer w0.254: U29.4 10.47,12.48 10.21,12.22 8.86,12.22 8.57,11.93 U29.1
  Top Layer w0.381: 39.35,14.15 39.47,14.15 40.36,13.26 ; 40.36,13.26 40.64,12.98 ; 40.36,13.26 40.36,10.12 ; 40.36,10.12 39.59,9.35 38.97,9.35 ; 40.36,10.12 40.64,10.4 40.64,12.52
  Top Layer w0.508: U52.6 v1(3.88,5.72)
  Top Layer w0.635: 40.51,12.52 40.51,13.29
  Top Layer w0.762: R115.1 41.08,18.57 ; C116.2 C115.2 40.67,18.78 D19.1 40.77,17.3 41.48,16.59 v1(41.48,15.88) v1(41.48,15.23) v1(41.48,14.56) 41.48,14.25 v1(41.18,13.95) 40.51,13.29
  GND05 w0.508: v1(24.93,13.62) 25.19,13.87 26.36,13.87 26.84,13.4 v1(26.84,12.9) ; v1(3.88,5.72) 3.88,2.5 5.2,1.17 v1(7.99,1.17)
  GND05 w0.762: 8.79,1.97 v1(7.99,1.17) v1(8.79,1.17) v1(8.79,1.91) 8.79,1.97 ; 8.79,1.97 v1(8.79,2.67) 8.79,4.24 9.25,4.69 9.25,10.14 8.56,10.82 8.56,11.96 10.11,13.51 v1(10.11,13.92) ; 8.86,14.58 10.09,14.58 ; 8.86,14.58 9.58,14.45 v1(10.11,13.92) ; 8.86,14.58 7.06,14.58 5.77,15.88 5.77,23.7 10.29,28.22 19.18,28.22 21.89,25.5 34.06,25.5 35,24.56 35,21.82 35.79,21.03 40.1,21.03 ; 40.1,21.03 39.9,20.83 v1(39.9,18.79) 39.9,18.07 41.48,16.49 v1(41.48,15.88) v1(41.48,15.23) v1(41.48,14.56) 41.48,14.25 v1(41.18,13.95) 36.25,9.02 32.54,9.02 ; 40.1,21.03 40.64,21.57 v1(43.56,21.57) v1(44.27,21.57) ; v1(10.11,13.92) v1(10.11,14.6)
  Bottom Layer w0.254: U53.4 12.36,10.63 12.65,10.92 12.65,12.32 12.86,12.53 14.13,12.53
  Bottom Layer w0.508: U28.4 v1(24.93,13.62) ; v1(26.84,12.9) 26.84,12.02 U28.1 ; v1(39.9,18.79) 39.62,19.07 U27.1 ; C111.2 11.01,14.6 v1(10.11,14.6) v1(10.11,13.92) ; v1(43.56,21.57) v1(44.27,21.57)
  Bottom Layer w0.635: 8.76,1.88 v1(8.79,1.91) ; 8.76,1.88 8.05,1.17 ; 8.76,1.88 8.76,2.49 7.27,3.98 7.27,7.33 8.74,8.79 11.36,8.79 C146.2 11.62,10.54 U53.4 ; 8.76,1.88 8.76,1.2 v1(8.79,1.17) 8.05,1.17 ; 8.05,1.17 v1(7.99,1.17) ; C107.2 43.56,21.17 U27.4 ; v1(32.75,8.63) 34.35,8.63 35.08,9.35 35.08,13.18 34.44,13.82 30.17,13.82 29.54,13.18 29.54,12.48 28.91,11.85 C109.2 ; U28.1 28.45,12.01
  vias: v1(32.28,9.25) v1(33.1,9.25)
AGND: length 100.4
  Top Layer w0.203: T1.91 29.22,8.06 28.85,7.7 28.85,6.5 ; 28.17,5.73 28.85,6.41 28.85,6.5 ; 28.85,6.5 29.62,5.73
  Top Layer w0.254: v1(31.29,12.74) v1(30.61,12.74) 29.78,12.74 29.22,12.18 T1.91
  Top Layer w0.508: C83.2 27.33,4.99 27.33,3.75 v1(26.57,3) 26.32,2.74 25.6,2.74 24.95,2.09 R79.2 24.24,0.92 R146.1 ; v1(20.37,0.92) 15.75,0.92 15.01,1.65 15.01,5.96 C143.2 15.94,7.1 16.66,7.83 21.69,7.83 22.35,7.17 22.35,6.1 22.73,5.72 v1(24.18,5.72)
  GND02 w0.508: 29.97,10.92 24.76,5.72 v1(24.18,5.72) 23.72,5.72 21.7,7.74 16.76,7.74 15.27,6.25 15.27,1.5 15.85,0.92 v1(20.37,0.92) 24.49,0.92 v1(26.57,3) 27.28,3.7 27.28,4.93 27.97,5.61 29.16,5.61 29.97,6.43 29.97,10.92 ; 29.97,10.92 29.97,12.11 v1(30.61,12.74) v1(31.29,12.74) 31.29,12.24 29.97,10.92
  Bottom Layer w0.762: v1(20.37,0.92) 21.67,0.92 23.75,3 v1(26.57,3) ; v1(30.61,12.74) v1(31.29,12.74) C31.1 C88.1
GND: length 611.7
  Top Layer w0.152: USB9.A1 USB9.B12
  Top Layer w0.203: T1.99 33.81,11.87 34.5,11.18 ; 35.1,11.18 34.5,11.18 ; 34.5,11.18 34.8,10.88 ; 34.8,10.88 34.82,10.89 35.24,10.89 35.25,10.88 35.4,10.88 ; 34.8,10.88 35.48,10.2
  Top Layer w0.254: v1(8.15,17.6) 7.26,17.6 6.73,17.07 FPC2.19 ; v1(8.15,20.52) 7.7,20.07 FPC2.13 ; FPC2.10 v1(8.15,21.57) 8.15,22.68 7.76,23.07 FPC2.7 4.97,23.07 4.77,23.27 v1(4.77,23.82) ; v1(2.36,13.72) 2.36,14.78 3.15,15.57 FPC2.22 ; v1(7.49,19.13) 6.94,18.57 FPC2.16
  Top Layer w0.381: U41.1 16.1,32.87 ; 35.51,10.41 35.51,10.13 ; 35.51,10.41 35.15,10.77 35.25,10.88 ; 35.51,10.41 35.48,10.38 35.48,8.36 36.06,7.78 R113.1 ; 35.51,10.41 35.92,10.82 ; R142.2 34.46,25.48 U34.2 v1(36.79,25.48) ; v1(35.98,10.88) 35.68,11.18 35.1,11.18 ; v1(35.98,10.88) 35.92,10.82 ; v1(35.98,10.88) U35.1 ; U36.1 35.7,14.44 ; v1(13.72,9.05) 13.43,9.35 v1(13.43,11.58) ; 35.92,10.82 35.46,10.82 35.1,11.18 ; v1(12.76,21.67) 12.8,21.67 14.4,20.07 FPC7.1 ; 35.1,11.18 34.92,11 ; v1(17.14,26.98) 16.81,26.65 U21.2 ; U33.1 v1(35.31,27.78)
  Top Layer w0.508: v1(30.71,8.26) 30.72,8.26 C139.1 ; v1(35.23,4.02) 35.23,5.74 34.77,6.2 34.77,6.92 34.14,7.55 v1(34.14,9.98) ; v1(15.8,29.67) C121.1 16.57,29.62 16.57,27.55 v1(17.14,26.98) ; v1(15.8,29.67) 15.16,29.03 C41.1 ; v1(15.8,29.67) v1(15.8,31.42) 15.8,32.56 16.1,32.87 v1(16.33,33.1) v1(20.9,33.1) ; C124.1 8.39,7.32 v1(8.39,6.61) 7.49,5.71 C141.1 10.32,3.77 11.3,2.8 11.3,1.65 11.43,1.65 v1(12.62,2.85) 12.69,2.91 v1(12.69,7.29) 12.04,7.29 ; 23.01,33.1 26.39,33.1 26.7,32.79 ; 23.01,33.1 23.23,32.88 X1.4 ; 23.01,33.1 v1(20.9,33.1) ; R141.1 36.94,21.91 37.3,22.26 v1(37.9,22.26) 37.9,21.34 37.59,21.03 C116.1 37.59,20.03 39.12,20.03 ; v1(20.9,33.1) 21.69,32.3 v1(21.69,29.64) ; 8.15,19.79 v1(8.15,17.6) 8.69,17.6 8.89,17.4 R112.1 12.2,16.53 FPC7.8 14.35,14.38 ; 8.15,19.79 v1(8.15,20.52) v1(8.15,21.57) 12.66,21.57 v1(12.76,21.67) 12.89,21.8 C17.1 10.59,24.21 9.83,24.97 SW1.2 v1(8.46,28.02) ; 8.15,19.79 v1(7.49,19.13) ; C120.2 21,29.64 v1(21.69,29.64) ; C123.1 26.44,28.26 v1(26.44,28.96) 26.44,29.24 X1.2 25.87,30.24 26.7,31.07 v1(26.7,31.82) 26.7,32.79 ; C91.1 35.7,14.25 R114.2 ; 26.7,32.79 26.7,34.39 v1(26.17,34.91) ; USB9.3 43.69,4.85 NOREF#9.1 40.08,1.25 v1(39.09,1.25) 39.08,1.25 R135.1 ; USB9.3 USB9.4 ; USB9.3 USB9.1 39.51,7.71 USB9.A1 38.71,8.51 37.25,8.51 R113.1 ; C27.1 14.35,14.38 ; 14.35,14.38 14.35,14.84 v1(14.41,14.9) ; v1(30.81,7.11) 31.28,7.58 C139.1 ; 11.3,1.52 v1(11.3,0.8) ; v1(21.69,29.64) 22.22,29.12 22.22,28.24 21.94,27.97 v1(21.46,27.97) ; v1(3.41,27.76) 2.97,27.76 v1(1.17,25.96) ; v1(3.41,27.76) v1(3.41,25.94) ; v1(3.41,27.76) 8.2,27.76 v1(8.46,28.02) ; v1(8.46,28.02) 8.46,31.22 v1(8.66,31.42) SW2.2 ; U52.2 v1(4.83,4.73) ; 39.51,22.76 38.86,23.41 USB10.A1 ; v1(13.72,9.05) 14.2,9.05 C112.1 ; 24.02,16.15 21.49,13.62 v1(21.49,11.74) v1(21.49,10.92) ; v1(18.94,21.24) 21.05,21.24 T1.129 25.88,16.41 v1(25.88,12.96) ; v1(35.66,35.39) 36.29,35.39 36.56,35.12 U1.4 ; C139.1 31.52,7.94 v1(31.52,8.41) ; USB10.A12 38.86,30.75 USB10.2 USB10.4 43.69,22.76 43.08,22.76 42.38,22.06 LED3.1 ; 26.46,1.63 v1(27.2,1.63) 28.08,1.63 C138.1 29.56,1.61 R138.1 ; USB9.A12 38.86,15.38 USB9.2 36.58,16.03 v1(36.1,15.55) 36.1,15.54 35.7,15.14 ; U29.2 v1(9.52,11.48) ; 2.71,8.05 C119.1 2.6,9.08 v1(3.41,9.88) 3.76,9.54 v1(3.76,8.05) 2.71,8.05
  Top Layer w0.762: 39.51,22.76 39.01,22.26 v1(37.9,22.26) ; v1(3.41,9.88) 5.31,9.88 v1(5.62,9.57) R120.1 ; C116.1 37.34,20.44 C30.1 ; C30.1 36.07,20.46 R141.1 35.99,21.98 C19.1 34.54,20.47 C28.1 C30.1
  SIG03 w0.381: 26.02,18.15 26.49,18.62 26.49,22.4 26.82,22.73 26.82,24.72 27.79,25.68 32.99,25.68 33.58,25.1 36.4,25.1 v1(36.79,25.48)
  SIG03 w0.508: 39.51,22.76 39.51,20.94 38.76,20.19 38.76,18.26 39.51,17.51 39.51,17.28 ; 39.51,22.76 38.39,22.76 v1(37.9,22.26) 37.51,21.87 36.22,21.87 35.52,21.17 35.52,20.66 37.26,18.92 37.26,16.71 36.58,16.03 ; 39.51,22.76 39.51,23.46 39.29,23.67 ; 39.51,22.76 43.69,22.76 USB10.4 USB10.2 ; USB9.3 USB9.1 ; USB9.3 USB9.4 42.72,16.03 41.45,17.3 39.53,17.3 39.51,17.28 ; USB9.3 43.69,4.85 NOREF#9.1 39.51,5.47 USB9.1 ; USB9.1 39.51,8.12 39.29,8.33 ; USB9.2 36.58,16.03 ; USB9.2 39.51,15.31 39.04,14.83 ; USB9.2 39.51,17.28 ; 36.58,16.03 v1(36.1,15.55) 36.1,16.05 35.56,16.59 34.44,16.59 33.76,17.27 33.76,22.66 34.67,23.57 37.03,23.57 37.54,24.08 37.54,24.97 37.03,25.48 v1(36.79,25.48) ; 39.29,30.48 39.51,30.7 USB10.2 ; USB10.2 37.77,31.4
  Bottom Layer w0.381: C147.1 16.06,13.68 14.99,14.76 C36.1 ; 25.7,35.39 26,35.69 27.58,35.69 27.91,36.01 U11.36 ; v1(13.43,11.58) 13.18,11.34 13.18,9.21 C146.1 ; v1(12.69,7.29) 11.96,7.29 11.81,7.14 U38.2 ; v1(36.79,25.48) 36.88,25.48 ; 24.51,12.96 v1(25.88,12.96) ; U24.3 8.15,6.37 v1(8.39,6.61) U37.1
  Bottom Layer w0.508: 35.07,7.74 35.23,7.9 ; 35.07,7.74 35.23,7.74 ; 35.07,7.74 U49.1 32.19,7.74 v1(31.52,8.41) 30.86,8.41 v1(30.71,8.26) ; 35.23,7.9 35.98,8.65 v1(35.98,10.88) ; 35.23,7.9 35.23,7.74 ; 8.5,15.62 8.5,17.26 v1(8.15,17.6) 7.49,18.26 v1(7.49,19.13) 8.15,19.79 v1(8.15,20.52) v1(8.15,21.57) ; 26.02,17.15 26.02,18.15 25.02,18.15 ; 26.02,17.15 25.02,17.15 ; 26.02,17.15 26.02,16.15 25.02,16.15 ; R151.1 9.94,11.06 v1(9.52,11.48) ; C1.2 21.82,8.65 C12.1 C9.1 22.26,10.15 v1(21.49,10.92) v1(21.49,11.74) ; v1(12.69,7.29) 12.69,3.25 U24.4 13.1,2.59 v1(11.3,0.8) ; CN2.4 29.6,8.52 C15.1 ; C64.1 C63.1 38.35,26.72 37.11,25.48 36.88,25.48 ; v1(8.66,31.42) 8.66,30.66 ; 8.66,30.66 8.17,30.17 U5.16 v1(4.8,30.17) 4.41,30.17 3.41,29.17 v1(3.41,27.76) v1(3.41,25.94) ; 8.66,30.66 8.66,28.22 v1(8.46,28.02) 9.47,27 9.47,24.77 8.53,23.82 8.23,23.82 ; 35.23,7.74 39.16,7.74 USB9.1 USB9.3 USB9.4 ; 35.23,7.74 v1(35.23,4.02) 34.22,3 U50.1 30.35,3 CN2.3 28.97,1.63 v1(27.2,1.63) ; v1(12.76,21.67) 12.66,21.57 v1(8.15,21.57) ; v1(3.76,8.05) 3.76,7.6 R121.1 4.6,6.7 4.6,4.96 v1(4.83,4.73) 5.7,3.86 5.7,2.84 ; 20.17,21.24 C38.1 C21.1 24.12,21.24 C65.1 ; 20.17,21.24 19.79,20.86 C29.1 ; 20.17,21.24 v1(18.94,21.24) 18.34,21.24 17.68,20.58 ; C147.1 15.72,12.6 14.71,11.58 U53.2 ; v1(20.9,33.1) 20.9,31.73 21.69,30.94 v1(21.69,29.64) 21.46,29.41 v1(21.46,27.97) 21.46,26.4 C34.1 C33.1 ; v1(2.36,13.72) 2.36,10.93 v1(3.41,9.88) 5.31,9.88 v1(5.62,9.57) ; C110.1 23.5,16.15 24.02,16.15 ; C16.1 12.31,15.18 11.52,15.97 C111.1 ; 12.79,21.69 12.88,21.77 16.65,21.77 17.68,20.75 17.68,20.58 ; 26.7,33 v1(26.7,31.82) 26.44,31.56 v1(26.44,28.96) 26.44,27.29 27.91,25.82 U11.20 ; 26.7,33 26.7,34.39 v1(26.17,34.91) 25.7,35.39 U11.33 ; 26.7,33 26.1,33.59 U11.31 ; 23.36,17.03 23.47,17.15 24.02,17.15 ; 17.68,20.58 C13.1 ; v1(37.9,22.26) 38.39,22.76 43.69,22.76 USB10.4 USB10.2 ; 8.23,23.82 U5.11 v1(4.77,23.82) 4.33,23.82 3.4,24.74 3.4,25.93 v1(3.41,25.94) ; 8.23,23.82 8.76,23.29 8.76,22.18 v1(8.15,21.57) ; 25.02,17.15 25.02,18.15 ; 25.02,17.15 24.02,17.15 ; 25.02,17.15 25.02,16.15 ; 25.02,16.15 24.02,16.15 ; 24.02,16.15 24.02,17.15 ; R107.1 39.44,16.1 USB9.2 38.56,16.03 38.16,15.63 C108.1 37.33,15.55 v1(36.1,15.55) ; U11.1 v1(35.66,35.39) 35.28,35.01 35.28,34.01 35.7,33.59 U11.3 ; 8.15,5.15 U24.3 ; 24.02,18.15 23.82,18.15 C14.1 23.32,15.52 24.08,14.76 24.08,13.39 24.51,12.96 ; 24.02,18.15 25.02,18.15 ; 24.02,18.15 24.02,17.15 ; C109.1 28.08,13.64 26.21,13.64 25.88,13.31 v1(25.88,12.96) U28.2 ; v1(3.41,25.94) 3.39,25.96 v1(1.17,25.96) ; C37.1 15.19,8.28 14.42,9.05 v1(13.72,9.05) 13.72,9.04 C146.1 ; 14.13,11.58 v1(13.43,11.58) ; U27.2 43.11,20.22 C107.1 ; v1(17.14,26.98) 15.8,28.32 v1(15.8,29.67) v1(15.8,31.42) 15.8,32.56 v1(16.33,33.1) ; 3.41,34.59 NOREF#6.1 ; 32.04,31.84 33.04,31.84 33.04,32.84 32.04,32.84 32.04,31.84
  Bottom Layer w0.635: 8.5,14.15 8.5,15.62
  Bottom Layer w0.762: 8.5,15.62 8.85,15.97 C111.1 ; C16.1 13.48,15.18 13.86,14.8 C36.1 ; C21.1 23.36,20.52 R123.1 23.36,16.02 C110.1 ; R111.1 26.22,16.35 26.02,16.15
  vias: v1(41.9,20.18)
VIN5V: length 15
  Top Layer w0.381: 40.45,28.54 39.45,29.54 39.37,29.54 ; 40.45,28.54 40.45,25.63 ; 40.45,28.54 40.74,28.25 40.74,25.8 40.61,25.8 ; 39.36,24.64 39.46,24.64 40.38,25.56
  Top Layer w0.508: 40.61,25.8 40.61,26.48
  Top Layer w0.762: 40.66,25.56 41.3,24.92 41.3,22.2 40.77,21.67 40.77,20.54
BTN1: length 15.5
  Top Layer w0.152: SW5.1 11.3,7.27 U42.2 9.82,7.29 9.77,7.34 9.8,7.37 R126.1 10.52,8.94 11.1,8.36 15.42,8.36 15.67,8.61 19.46,8.61 19.62,8.77 T1.67
DXIN: length 6.8
  Top Layer w0.152: X1.1 24.08,29.39 24.08,28.7 C122.2 ; 23.81,28.05 24.05,27.8 24.05,27.66 23.5,27.1 22.91,27.1 22.42,26.61 T1.23
DXOUT: length 9.2
  Top Layer w0.152: 24.9,28.24 24.78,28.24 24.45,27.91 24.45,27.6 23.57,26.72 22.99,26.72 22.82,26.55 T1.22 ; 24.9,28.24 C123.2 ; 24.9,28.24 24.41,28.73 24.41,31.02 25.46,32.06 ; 22.81,24.92 22.81,24.93
HPOUT_FB: length 2.3
  Top Layer w0.152: T1.100 33.95,12.27 34.2,12.03 C91.2
HPOUTR: length 10
  Top Layer w0.203: 33.66,11.43 33.75,11.43 34.17,11.02 ; 33.93,11.13 33.59,11.47 T1.98
  Top Layer w0.381: 34.04,11.02 34.8,10.27 34.8,7.94 35.43,7.3 35.43,6.82 C142.1 C135.1
LCD_CLK_N: length 40.9
  Top Layer w0.124: FPC2.14 5.24,19.57 5.15,19.49 4.52,19.49 4.29,19.72 3.67,19.72 v1(3.45,19.93) ; T1.60 18.24,12.67 18.28,12.71 18.91,12.71 19.58,13.38 19.86,13.38 20.08,13.16 v1(20.51,13.16)
  SIG03 w0.124: v1(20.51,13.16) 20.29,13.38 16.08,13.38 15.42,14.05 13.97,14.05 13.32,14.69 11.85,14.69 9.17,17.37 9.17,17.95 8.91,18.22 7.07,18.22 6.93,18.08 6.93,16.54 7.19,16.28 8.89,16.28 9.24,15.93 9.24,14.63 8.86,14.25 2.92,14.25 2.21,14.96 2.21,19.03 2.9,19.72 3.24,19.72 v1(3.45,19.93)
LCD_CLK_P: length 41
  Top Layer w0.124: FPC2.15 5.24,19.07 5.15,19.16 4.38,19.16 4.15,19.39 3.67,19.39 v1(3.45,19.17) ; T1.59 18.24,13.07 18.28,13.04 18.77,13.04 19.44,13.71 19.86,13.71 20.08,13.93 v1(20.51,13.93)
  SIG03 w0.124: v1(20.51,13.93) 20.29,13.71 17.95,13.71 arc(17.84,13.75) 17.79,13.87 arc(17.75,13.98) 17.63,14.02 17.57,14.02 arc(17.46,13.98) 17.41,13.87 arc(17.36,13.75) 17.25,13.71 17.19,13.71 arc(17.07,13.75) 17.03,13.87 arc(16.98,13.98) 16.87,14.02 16.8,14.02 arc(16.69,13.98) 16.65,13.87 arc(16.6,13.75) 16.49,13.71 16.22,13.71 15.55,14.38 14.1,14.38 13.46,15.02 11.98,15.02 9.5,17.5 9.5,18.09 9.04,18.54 6.93,18.54 6.6,18.21 6.6,16.4 7.05,15.96 8.75,15.96 8.92,15.79 8.92,14.77 8.73,14.58 3.06,14.58 2.54,15.1 2.54,17.9 arc(2.59,18.03) 2.73,18.09 ; v1(3.45,19.17) 3.24,19.39 3.03,19.39 2.54,18.89 2.54,18.66 arc(2.59,18.53) 2.73,18.47 ; 2.73,18.47 arc(2.92,18.28) 2.73,18.09
LCD_PWM: length 22.5
  Top Layer w0.152: U52.4 5.78,7.81 v1(6.03,8.06) R120.2 ; T1.52 18.36,15.87 v1(18.77,16.28)
  Power04 w0.152: v1(6.03,8.06) 11.18,8.06 13.74,10.62 17.53,10.62 18.77,11.86 v1(18.77,16.28)
LED1: length 8.7
  Top Layer w0.152: T1.68 20.02,8.56 19.79,8.33 15.98,8.33 13.84,6.19 LED4.1
LEDA: length 5.6
  Top Layer w0.508: v1(4.83,8.06) U52.5
  Bottom Layer w0.508: v1(4.83,8.06) 4.83,8.54 4.46,8.9 v1(1.17,8.9)
LEDK: length 1.1
  Bottom Layer w0.152: 6.15,6.72 6.14,6.73
  Bottom Layer w0.508: v1(6.15,5.64) 6.15,6.72
  vias: v1(3.94,12.93) v1(4.04,12.29) v1(4.61,12.93) v1(4.72,12.3) v1(5.36,5.64) v1(5.67,5.04) v1(6.35,4.94)
MIC_IN_3N: length 10.5
  Top Layer w0.127: T1.88 28.02,8.64 27.61,8.23 26.31,8.23 25.5,7.42 25.5,3.58 25.07,3.15 23.96,3.15 C86.2
MIC_IN_3P: length 9.9
  Top Layer w0.127: C85.2 23.92,3.48 24.97,3.48 25.2,3.71 25.2,7.52 26.19,8.51 27.46,8.51 27.62,8.67 T1.87
MIPI_0_N: length 40.6
  Top Layer w0.124: T1.56 18.24,14.27 18.28,14.31 18.54,14.31 19.63,15.4 19.93,15.4 v1(20.24,15.7) ; v1(4.81,16.6) 4.84,16.57 FPC2.20
  SIG03 w0.124: v1(4.81,16.6) 4.8,16.62 4.8,17.33 arc(4.85,17.45) 4.96,17.5 arc(5.08,17.55) 5.13,17.67 5.13,17.71 arc(5.08,17.83) 4.96,17.88 arc(4.85,17.93) 4.8,18.05 4.8,18.1 arc(4.85,18.21) 4.96,18.26 arc(5.08,18.31) 5.13,18.43 5.13,18.48 arc(5.08,18.59) 4.96,18.64 arc(4.85,18.69) 4.8,18.81 4.8,19.32 5.76,20.29 5.76,24 6.08,24.31 7.26,24.31 arc(7.4,24.25) 7.45,24.12 7.45,23.72 arc(7.97,23.21) 8.49,23.72 8.49,24.12 arc(8.68,24.31) 8.87,24.12 8.87,23.72 arc(9.39,23.21) 9.91,23.72 9.91,24.12 arc(9.96,24.25) 10.1,24.31 11.07,24.31 11.35,24.02 11.35,17.72 12.44,16.64 14.22,16.64 14.61,17.02 arc(14.74,17.08) 14.88,17.02 14.9,17 arc(15.17,17) 15.17,17.27 15.15,17.29 arc(15.09,17.43) 15.15,17.56 15.52,17.93 16.71,17.93 17.09,17.55 17.09,16.69 18.39,15.4 19.63,15.4 19.93,15.7 v1(20.24,15.7)
MIPI_0_P: length 40.7
  Top Layer w0.124: v1(19.7,16.24) 19.39,15.94 19.39,15.63 18.4,14.64 18.28,14.64 18.24,14.67 T1.55 ; FPC2.21 4.2,16.07 v1(4.1,16.17)
  SIG03 w0.124: v1(19.7,16.24) 19.7,15.93 19.49,15.72 18.52,15.72 17.42,16.83 17.42,17.69 16.85,18.26 15.38,18.26 14.09,16.97 12.58,16.97 11.68,17.86 11.68,24.16 11.2,24.64 10.1,24.64 arc(9.73,24.49) 9.58,24.12 9.58,23.72 arc(9.39,23.53) 9.2,23.72 9.2,24.12 arc(8.68,24.64) 8.16,24.12 8.16,23.72 arc(7.97,23.53) 7.78,23.72 7.78,24.12 arc(7.63,24.49) 7.26,24.64 5.94,24.64 5.44,24.13 5.44,20.42 4.47,19.46 4.47,16.99 4.1,16.62 v1(4.1,16.17)
MIPI_1_N: length 40.7
  Top Layer w0.124: T1.58 18.24,13.47 18.28,13.51 18.75,13.51 19.99,14.75 20.4,14.75 20.62,14.53 v1(21.05,14.53) ; v1(3.89,18.2) 4.1,17.99 5.15,17.99 5.24,18.07 FPC2.17
  SIG03 w0.124: v1(3.89,18.2) 3.67,17.99 3.3,17.99 2.93,17.61 2.93,15.9 3.73,15.09 4.94,15.09 5.9,16.05 5.9,19.18 6.63,19.91 6.63,22 6.91,22.28 10.16,22.28 10.39,22.05 10.39,17.39 12.26,15.52 14.96,15.52 15.52,16.08 16.33,16.08 18.13,14.28 19.94,14.28 20.41,14.75 20.83,14.75 v1(21.05,14.53)
MIPI_1_P: length 40.5
  Top Layer w0.124: FPC2.18 5.24,17.57 5.15,17.66 4.1,17.66 v1(3.89,17.44) ; v1(21.05,15.29) 20.62,15.29 20.4,15.08 19.85,15.08 18.61,13.84 18.28,13.84 18.24,13.87 T1.57
  SIG03 w0.124: v1(3.89,17.44) 3.67,17.65 3.44,17.65 3.25,17.47 3.25,17.15 arc(3.31,17.02) 3.44,16.96 3.49,16.96 arc(3.68,16.77) 3.49,16.58 3.44,16.58 arc(3.31,16.52) 3.25,16.39 3.25,16.03 3.87,15.42 4.8,15.42 5.57,16.19 5.57,19.31 6.3,20.05 6.3,22.14 6.77,22.6 10.3,22.6 10.72,22.18 10.72,17.53 12.4,15.85 14.82,15.85 15.38,16.41 16.47,16.41 18.27,14.61 18.63,14.61 arc(18.74,14.65) 18.79,14.76 arc(18.83,14.87) 18.94,14.91 19.02,14.91 arc(19.12,14.87) 19.17,14.76 arc(19.21,14.65) 19.32,14.61 19.81,14.61 20.27,15.08 20.83,15.08 v1(21.05,15.29)
MIPI_2_N: length 40.8
  Top Layer w0.124: v1(2.34,21.18) 2.71,21.55 2.71,21.88 2.97,22.14 3.56,22.14 3.85,21.85 4.13,21.85 4.41,21.58 4.41,21.07 4.5,20.99 5.15,20.99 5.24,21.07 FPC2.11 ; v1(19.85,11.69) 19.42,11.69 19.2,11.91 18.28,11.91 18.24,11.87 T1.62
  SIG03 w0.124: v1(2.34,21.18) 2.34,21 1.4,20.06 1.4,12.98 2.94,11.43 5.26,11.43 arc(5.62,11.59) 5.78,11.95 5.78,12.09 arc(5.97,12.28) 6.16,12.09 6.16,11.95 arc(6.31,11.59) 6.67,11.43 7.45,11.43 9,12.98 10.74,12.98 arc(11.11,13.14) 11.26,13.5 11.26,13.52 arc(11.45,13.71) 11.64,13.52 11.64,13.5 arc(12.16,12.98) 12.68,13.5 12.68,13.52 arc(12.87,13.71) 13.06,13.52 13.06,13.5 arc(13.21,13.13) 13.58,12.98 14.12,12.98 15.19,11.91 15.74,11.91 arc(16.09,12.06) 16.24,12.41 arc(16.29,12.54) 16.42,12.59 16.45,12.59 arc(16.57,12.54) 16.62,12.41 arc(16.77,12.06) 17.13,11.91 17.16,11.91 arc(17.51,12.06) 17.66,12.41 arc(17.71,12.54) 17.84,12.59 17.86,12.59 arc(17.99,12.54) 18.04,12.41 arc(18.19,12.06) 18.54,11.91 19.63,11.91 v1(19.85,11.69)
MIPI_2_P: length 40.9
  Top Layer w0.124: v1(19.85,12.45) 19.42,12.45 19.2,12.24 18.28,12.24 18.24,12.27 T1.61 ; FPC2.12 5.24,20.57 5.15,20.66 4.36,20.66 4.08,20.94 4.08,21.44 3.99,21.53 3.72,21.53 3.43,21.82 3.1,21.82 3.03,21.75 3.03,21.24 v1(3.1,21.18)
  SIG03 w0.124: v1(19.85,12.45) 19.63,12.24 18.54,12.24 arc(18.42,12.29) 18.37,12.41 arc(18.22,12.77) 17.86,12.92 17.84,12.92 arc(17.48,12.77) 17.33,12.41 arc(17.28,12.29) 17.16,12.24 17.13,12.24 arc(17,12.29) 16.95,12.41 arc(16.8,12.77) 16.45,12.92 16.42,12.92 arc(16.06,12.77) 15.91,12.41 arc(15.86,12.29) 15.74,12.24 15.33,12.24 14.26,13.31 13.58,13.31 arc(13.44,13.37) 13.39,13.5 13.39,13.52 arc(12.87,14.03) 12.35,13.52 12.35,13.5 arc(12.16,13.31) 11.97,13.5 11.97,13.52 arc(11.45,14.03) 10.93,13.52 10.93,13.5 arc(10.88,13.37) 10.74,13.31 8.86,13.31 7.31,11.76 6.67,11.76 arc(6.54,11.82) 6.48,11.95 6.48,12.09 arc(5.97,12.61) 5.45,12.09 5.45,11.95 arc(5.39,11.82) 5.26,11.76 3.08,11.76 2.52,12.32 arc(2.46,12.46) 2.52,12.59 2.54,12.61 arc(2.54,12.88) 2.27,12.88 2.25,12.86 arc(2.11,12.81) 1.98,12.86 1.72,13.12 1.72,19.8 2.24,20.32 arc(2.37,20.37) 2.51,20.32 2.58,20.25 arc(2.84,20.25) 2.84,20.52 2.77,20.58 arc(2.72,20.72) 2.77,20.85 v1(3.1,21.18)
MIPI_3_N: length 41.2
  Top Layer w0.124: FPC2.8 5.24,22.57 5.15,22.49 4.6,22.49 3.39,23.7 2.18,23.7 1.89,23.41 1.89,23 v1(1.68,22.78) ; v1(16.92,9.35) 16.7,9.57 16.7,10.42 16.23,10.9 16.23,11.02 16.31,11.11 16.44,11.11 16.47,11.07 T1.64
  SIG03 w0.124: v1(1.68,22.78) 1.91,23.01 1.91,23.19 1.78,23.32 0.96,23.32 0.84,23.19 0.84,22.45 arc(0.89,22.32) 1.03,22.26 1.08,22.26 arc(1.27,22.07) 1.08,21.88 1.03,21.88 arc(0.84,21.69) 1.03,21.5 1.08,21.5 arc(1.27,21.31) 1.08,21.12 1.03,21.12 arc(0.89,21.07) 0.84,20.93 0.84,12.76 2.68,10.92 7.72,10.92 9.34,12.55 13.88,12.55 15.02,11.41 15.85,11.41 16.71,10.55 16.71,9.57 v1(16.92,9.35)
MIPI_3_P: length 41.2
  Top Layer w0.124: FPC2.9 5.24,22.07 5.15,22.16 4.46,22.16 3.25,23.37 2.35,23.37 2.22,23.24 2.22,23 v1(2.44,22.78) ; v1(16.16,9.35) 16.38,9.57 16.38,10.28 15.9,10.76 15.9,11.16 16.18,11.44 16.44,11.44 16.47,11.47 T1.63
  SIG03 w0.124: v1(16.16,9.35) 16.38,9.58 16.38,10.41 15.71,11.08 14.88,11.08 13.74,12.22 9.48,12.22 7.85,10.59 2.54,10.59 0.51,12.63 0.51,23.34 0.81,23.65 1.98,23.65 2.23,23.39 2.23,22.98 v1(2.44,22.78)
MIPI_LCD_RST: length 16.4
  Top Layer w0.158: v1(4.57,13.72) 4.93,14.07 FPC2.25 ; v1(16.06,14.65) 16.21,14.8 16.23,14.8 16.51,15.09 17.31,15.09
  Power04 w0.158: v1(4.57,13.72) 4.57,15.04 5.08,15.55 14.68,15.55 15.57,14.65 v1(16.06,14.65)
MIPI_LCD_TE: length 19.1
  Top Layer w0.158: T1.53 16.05,15.47 ; v1(3.35,13.72) 3.35,14.35 3.78,14.78 4.85,14.78 5.06,14.57 FPC2.24
  Power04 w0.158: v1(16.06,15.47) 15.36,15.47 14.91,15.93 4.83,15.93 3.35,14.45 v1(3.35,13.72)
PA_SHDN: length 36.3
  Top Layer w0.152: U47.1 31.03,1.51 30.23,0.71 v1(26.47,0.71) ; T1.86 v1(27.22,10.89)
  Top Layer w0.254: R138.2 31.02,3.07 31.41,2.68 U47.1
  SIG03 w0.152: v1(27.22,10.89) 30.13,13.79 33.43,13.79 34.9,12.32 34.9,9.27 31.95,6.33 31.95,3.76 30.37,2.18 26.92,2.18 26.47,1.73 v1(26.47,0.71)
RESET: length 21.9
  Top Layer w0.152: SW2.1 14.86,32.09 14.86,32.69 ; T1.27 20.82,25.79 20.52,26.09 17.91,26.09 17.2,25.38 12.73,25.38 12.01,26.1 R13.1 13.45,29.06 C41.2 13.47,29.96 12.98,30.46 12.98,32.26 13.59,32.87 U41.2
SPI0_CLK: length 11.6
  Top Layer w0.152: T1.19 24.02,26.18 25.09,27.26 27.15,27.26 27.3,27.41 27.3,32.56 27.71,32.97 U1.6
SPI0_CS: length 24.3
  Top Layer w0.152: 35.38,30.43 34.85,29.9 31.55,29.9 31.09,29.44 28.2,29.44 27.86,29.11 27.86,27.18 27.56,26.88 25.25,26.88 24.42,26.05 T1.18 ; 35.38,30.43 U1.1 ; 35.38,30.43 34.85,30.96 34.85,34.55 34.34,35.05 32.72,35.05 32.44,35.33 R122.1
SPI0_HOLD: length 19
  Top Layer w0.152: v1(25.76,23.37) 25.76,23.66 26.02,23.91 T1.14 ; U1.7 29.54,31.7 v1(29.69,31.85) 29.72,31.88 29.72,32.39 30.35,33.02 30.35,34.62 29.35,35.62 R93.1
  SIG03 w0.152: v1(29.69,31.85) 28.34,31.85 27.66,31.17 27.66,28.96 25.76,27.06 v1(25.76,23.37)
SPI0_MISO: length 15.5
  Top Layer w0.152: U1.2 36.36,31.5 v1(35.44,31.5) ; T1.16 25.22,25.8 25.58,26.16 28.22,26.16 29.13,27.08 29.13,28.45 29.46,28.78 v1(30.02,28.78)
  SIG03 w0.152: v1(35.44,31.5) 34.37,31.5 33.38,30.51 32.18,30.51 30.91,29.24 30.48,29.24 v1(30.02,28.78)
SPI0_MOSI: length 37.6
  Top Layer w0.152: U1.5 v1(29.69,34.24) ; T1.17 24.82,25.94 25.43,26.54 27.94,26.54 28.42,27.03 v1(28.42,28.75) ; 15.55,26.65 v1(15.08,26.65) SW1.1
  SIG03 w0.152: v1(15.08,26.65) 15.08,28.06 15.7,28.68 24.26,28.68 24.89,29.31 24.89,33.28 25.86,34.24 v1(29.69,34.24) 30.48,33.45 30.48,31.49 30.03,31.04 28.88,31.04 28.42,30.58 v1(28.42,28.75)
SPI0_WP: length 25.2
  Top Layer w0.152: v1(35.44,32.28) 35.44,32.59 35.81,32.97 ; v1(25.5,22.53) 25.2,22.84 25.2,23.7 25.62,24.12 T1.15 ; R145.2 35.03,35.85 35.03,35.18 35.53,34.68 35.53,33.23 35.79,32.97 35.81,32.97 ; 35.81,32.97 U1.3
  SIG03 w0.152: v1(25.5,22.53) 26.06,22.53 26.36,22.84 26.36,26.67 27.58,27.89 28.83,27.89 29.11,28.17 29.11,29.41 29.39,29.69 30.68,29.69 31.93,30.94 33.07,30.94 34.42,32.28 v1(35.44,32.28)
TP_INT: length 5.9
  Top Layer w0.152: T1.42 15.99,19.87 15.69,19.57 FPC7.2 14.24,19.57 13.82,19.99 v1(13.23,19.99)
  Bottom Layer w0.152: v1(13.23,19.99) R163.1
TP_RST: length 5.3
  Top Layer w0.152: v1(14,18.07) FPC7.5 15.76,18.07 15.93,18.24 15.93,19.28 16.12,19.47 T1.43
  Bottom Layer w0.508: R160.1 14.68,18.07 v1(14,18.07)
TP_SCL: length 11.5
  Top Layer w0.152: v1(13.26,18.82) 14.02,18.82 14.27,18.57 FPC7.4 ; v1(18.75,19.38) 18.57,19.38 18.26,19.07 T1.44
  SIG03 w0.152: v1(13.26,18.82) 14.2,18.82 14.99,19.61 17.91,19.61 18.16,19.36 18.72,19.36 v1(18.75,19.38)
  Bottom Layer w0.152: v1(13.26,18.82) 12.39,17.96 R161.1
TP_SDA: length 16.8
  Top Layer w0.152: 20.93,19.43 20.35,18.85 18.54,18.85 18.37,18.67 T1.45 ; v1(12.32,19.41) 13.87,19.41 14.2,19.07 FPC7.3
  SIG03 w0.152: v1(20.93,19.38) 20.07,19.38 19.38,20.07 14.78,20.07 14.12,19.41 v1(12.32,19.41)
  Bottom Layer w0.152: v1(12.32,19.41) R162.1
UART0_RX: length 3.4
  Top Layer w0.152: v1(19.96,22.53) 19.96,23.14 19.63,23.47 T1.33
UART0_TX: length 5.5
  Top Layer w0.152: v1(15.67,22.68) 17.35,22.68 T1.35
  Bottom Layer w0.152: v1(15.67,22.68) 16.68,22.68 17.82,23.82 U5.8
UART1_CTS: length 14.3
  Top Layer w0.152: T1.4 30.02,27.68 31.7,29.36 32.56,29.36 v1(32.6,29.33)
  Bottom Layer w0.152: v1(32.6,29.33) 32.6,30.19 33.58,31.17 33.58,34.44 32.41,35.62 U11.41
UART1_RTS: length 14.8
  Top Layer w0.152: T1.3 30.42,27.5 31.6,28.68 33.42,28.68 34.06,29.32
  Bottom Layer w0.152: U11.44 35.11,35.62 34.82,35.34 34.82,30.58 34.06,29.82 34.06,29.32
  vias: v1(34.06,29.33)
UART1_RX: length 14
  Top Layer w0.152: T1.2 30.82,27.34 31.51,28.03 32.6,28.03
  Bottom Layer w0.152: U11.42 33.31,35.6 33.98,34.93 33.98,30.91 33.15,30.08 33.15,28.58 32.6,28.03
  vias: v1(32.6,27.99)
UART1_TX: length 14.8
  Top Layer w0.152: T1.1 31.22,27.13 31.52,27.43 33.5,27.43 v1(34.06,27.99)
  Bottom Layer w0.152: U11.43 34.21,35.52 34.39,35.33 34.39,30.79 33.5,29.9 33.5,28.55 v1(34.06,27.99)
UART3_RX: length 20.6
  Top Layer w0.152: T1.79 v1(24.42,10.9)
  SIG03 w0.152: v1(24.42,10.9) 24.09,11.23 23.5,11.23 19.56,7.29 15.08,7.29 14.69,6.91 14.05,6.91 v1(13.66,7.29) 13.84,7.29
  Bottom Layer w0.152: U24.1 10.24,5.75 10.24,6.8 U38.1 10.57,7.26 10.37,7.46 10.37,7.68 10.54,7.85 13.11,7.85 v1(13.66,7.29)
UART3_TX: length 22.2
  Top Layer w0.152: T1.80 24.82,10.49 25.22,10.9 v1(25.33,10.9)
  SIG03 w0.152: v1(25.33,10.9) 24.54,11.69 23.44,11.69 19.46,7.7 v1(14.35,7.7)
  Bottom Layer w0.152: v1(14.35,7.7) 14.33,7.7 13.87,8.16 10.29,8.16 9.83,7.7 9.83,7.4 U37.2 9.83,6.88 9.83,5.77 U24.2
USB0_DM: length 26.5
  Top Layer w0.158: T1.114 33.6,17.87 33.62,17.89 34.43,17.89 34.93,17.4 35.76,17.4 35.94,17.22 v1(36.17,17.22) ; v1(35.31,26.13) 35.51,26.34 35.86,26.34 U34.1 36.26,26.33 USB10.B7 39.66,26.33 39.83,26.49 39.83,27.18 39.67,27.33 38.86,27.33 USB10.A7
  SIG03 w0.158: v1(35.31,26.13) 35.56,26.39 37.52,26.39 38.15,25.76 38.15,23.85 37.11,22.82 34.8,22.82 34.23,22.25 34.23,18.04 34.85,17.42 35.97,17.42 v1(36.17,17.22)
USB0_DP: length 26.6
  Top Layer w0.158: 37.59,26.93 37.59,27.59 37.83,27.83 USB10.B6 ; USB10.A6 36.37,26.83 U33.2 35.81,26.88 35.43,26.88 v1(35.31,27) ; T1.115 33.6,18.27 33.62,18.25 34.58,18.25 35.08,17.76 35.76,17.76 35.99,17.98 v1(36.17,17.98)
  SIG03 w0.158: v1(36.17,17.98) 35.97,17.78 35,17.78 34.59,18.19 34.59,22.1 34.95,22.45 37.26,22.45 38.51,23.7 38.51,25.91 37.67,26.75 36.89,26.75 arc(36.76,26.8) 36.7,26.94 36.7,27.08 arc(36.51,27.27) 36.32,27.08 36.32,26.94 arc(36.26,26.8) 36.13,26.75 35.56,26.75 v1(35.31,27)
